# Altium project Liv_Flo_Sign.PrjPcb (part 1 of 2)
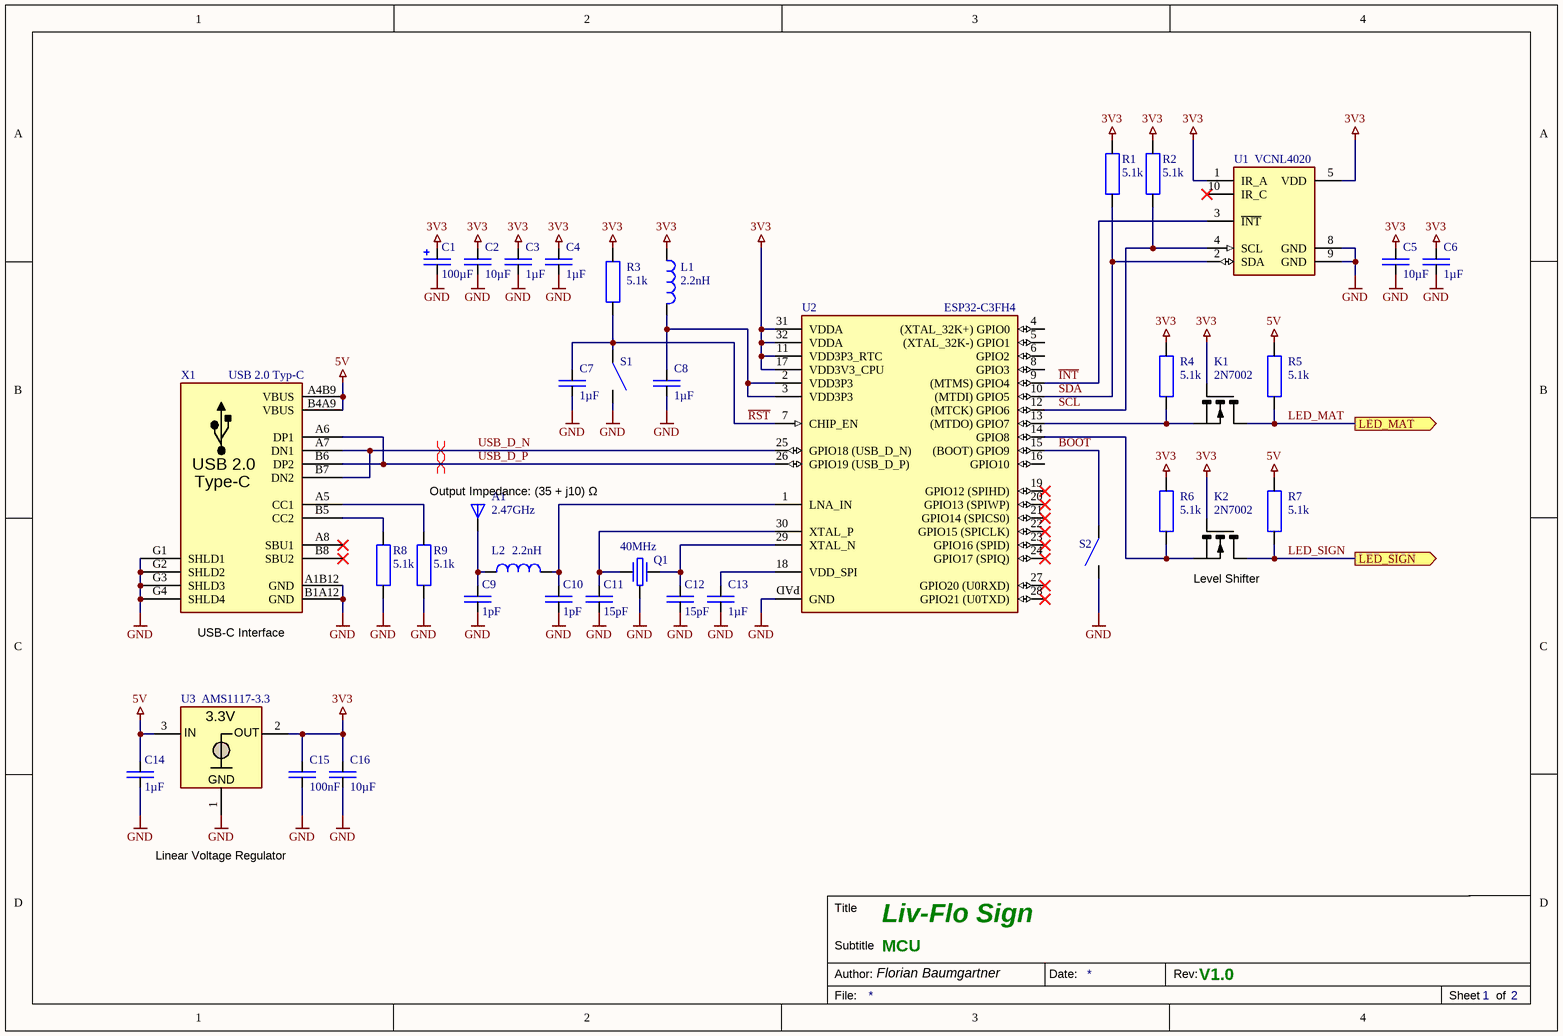
[diagram p0: Liv_Flo_Sign_MCU_V1.0.SchDoc]
2 sheets, 627 parts. Net scope: flat (ports and power ports of the same name join across sheets).
Board files: Liv_Flo_Sign_V1.0.PcbDoc, Liv_Flo_Sign_Feet_V1.0.PcbDoc
Sheets:
  Liv_Flo_Sign_MCU_V1.0.SchDoc
  Liv_Flo_Sign_LED_V1.0.SchDoc

## Sheet Liv_Flo_Sign_MCU_V1.0.SchDoc: Liv-Flo Sign
size A4; PageSetup: Record=PageOptions|CenterHorizontal=True|CenterVertical=True|PrintScale=0.97|XCorrection=1.00|YCorrection=1.00|PrintKind=0|BorderSize=5000000|LeftOffset=0|BottomOffset=0|Orientation=2|PaperLength=1000|PaperWidth=1000|Scale=100|PaperSource=7|PrintQuality=-3|MediaType=1|DitherType=10|PrintScaleMode=1|PaperKind=A4|PaperIndex=9; Organization: Crelin; Address2: Florian Baumgartner; DocumentNumber: MCU; Revision: V1.0; SheetNumber: 1; SheetTotal: 2; Author: Florian Baumgartner; Subtitle: Vertically Mounted Daughter-Board

### Parts
A1  2.47GHz  [SMD Chip-Antenna 7020 (SLDA72-2R470G-S1TF)]
C1  100µF  [SMD Tantalkondensator 1210 +]
C2  10µF  [SMD Keramikkondensator 0603]
C3  1µF  [SMD Keramikkondensator 0603]
C4  1µF  [SMD Keramikkondensator 0603]
C5  10µF  [SMD Keramikkondensator 0603]
C6  1µF  [SMD Keramikkondensator 0603]
C7  1µF  [SMD Keramikkondensator 0603]
C8  1µF  [SMD Keramikkondensator 0603]
C9  1pF  [SMD Keramikkondensator 0402]
C10  1pF  [SMD Keramikkondensator 0402]
C11  15pF  [SMD Keramikkondensator 0603]
C12  15pF  [SMD Keramikkondensator 0603]
C13  1µF  [SMD Keramikkondensator 0603]
C14  1µF  [SMD Keramikkondensator 0603]
C15  100nF  [SMD Keramikkondensator 0603]
C16  10µF  [SMD Keramikkondensator 0603]
K1  2N7002  [SMD MOSFET SOT-23]
K2  2N7002  [SMD MOSFET SOT-23]
L1  2.2nH  [SMD Inductor 0402]
L2  2.2nH  [SMD Inductor 0402]
Q1  40MHz  [SMD Crystal 2.5X2.0X0.5]
R1  5.1k  [SMD Widerstand 0603]
R2  5.1k  [SMD Widerstand 0603]
R3  5.1k  [SMD Widerstand 0603]
R4  5.1k  [SMD Widerstand 0603]
R5  5.1k  [SMD Widerstand 0603]
R6  5.1k  [SMD Widerstand 0603]
R7  5.1k  [SMD Widerstand 0603]
R8  5.1k  [SMD Widerstand 0603]
R9  5.1k  [SMD Widerstand 0603]
S1  SMD-Button  [SMD Button 4.2x3.2x2.5]  (value not drawn)
S2  SMD-Button  [SMD Button 4.2x3.2x2.5]  (value not drawn)
U1  VCNL4020  [SMD Proximity Sensor (VCNL4020)]
U2  ESP32-C3FH4  [SMD IC QFN-32]
U3  AMS1117-3.3  [SMD IC SOT-223]
X1  USB 2.0 Typ-C  [SMD USB-C Socket (A40-00119)]

### Ports
LED_MAT (out), LED_SIGN (out)

### Nets
3V3: C1.P(+) C2.2 C3.2 C4.2 C5.2 C6.2 C15.2 C16.2 K1.G K2.G L1.1 R1.1 R2.1 R3.1 R4.1 R6.1 U1.1(IR_A) U1.5(VDD) U2.11(VDD3P3_RTC) U2.17(VDD3V3_CPU) U2.31(VDDA) U2.32(VDDA) U3.2(OUT)
5V: C14.2 R5.1 R7.1 U3.3(IN) X1.A4B9(VBUS) X1.B4A9(VBUS)
GND: C1.M(-) C2.1 C3.1 C4.1 C5.1 C6.1 C7.1 C8.1 C9.2 C10.2 C11.2 C12.2 C13.1 C14.1 C15.1 C16.1 Q1.3 R8.2 R9.2 S1.2 S2.2 U1.8(GND) U1.9(GND) U2.PAD(GND) U3.1(GND) X1.A1B12(GND) X1.B1A12(GND) X1.G1(SHLD1) X1.G2(SHLD2) X1.G3(SHLD3) X1.G4(SHLD4)
BOOT: S2.1 U2.15((BOOT)_GPIO9)
~{INT}: U1.3(~{INT}) U2.9((MTMS)_GPIO4)
LED_MAT: K1.D R5.2 ; port LED_MAT
LED_SIGN: K2.D R7.2 ; port LED_SIGN
~{RST}: C7.2 R3.2 S1.1 U2.7(CHIP_EN)
SCL: R2.2 U1.4(SCL) U2.12((MTCK)_GPIO6)
SDA: R1.2 U1.2(SDA) U2.10((MTDI)_GPIO5)
USB_D_N: U2.25(GPIO18_(USB_D_N)) X1.A7(DN1) X1.B7(DN2)
USB_D_P: U2.26(GPIO19_(USB_D_P)) X1.A6(DP1) X1.B6(DP2)
NetA1_1: A1.1 C9.1 L2.1
NetC8_2: C8.2 L1.2 U2.2(VDD3P3) U2.3(VDD3P3)
NetC10_1: C10.1 L2.2 U2.1(LNA_IN)
NetC11_1: C11.1 Q1.1 U2.30(XTAL_P)
NetC12_1: C12.1 Q1.2 U2.29(XTAL_N)
NetC13_2: C13.2 U2.18(VDD_SPI)
NetK1_S: K1.S R4.2 U2.13((MTDO)_GPIO7)
NetK2_S: K2.S R6.2 U2.14(GPIO8)
NetR8_1: R8.1 X1.B5(CC2)
NetR9_1: R9.1 X1.A5(CC1)

Not connected (* = marked no-connect by the designer): U1 6(NC) 7(NC) 10(IR_C)*; U2 4((XTAL_32K+)_GPIO0) 5((XTAL_32K-)_GPIO1) 6(GPIO2) 8(GPIO3) 16(GPIO10) 19(GPIO12_(SPIHD))* 20(GPIO13_(SPIWP))* 21(GPIO14_(SPICS0))* 22(GPIO15_(SPICLK))* 23(GPIO16_(SPID))* 24(GPIO17_(SPIQ))* 27(GPIO20_(U0RXD))* 28(GPIO21_(U0TXD))*; X1 A8(SBU1)* B8(SBU2)*

### Layout directives
differential pair: USB_D_N, USB_D_P

### Notes on the sheet
- (near U2) Output Impedance: (35 + j10) Ω
- (near K2) Level Shifter
- (near X1) USB-C Interface
- Linear Voltage Regulator
- Title
- Author:
- Subtitle
- Date:
- Rev:
- File:
- Sheet
- of
- (in symbol U-AMS1117-3.3) 3.3V
- (in symbol X-USB-Buchse) USB 2.0; Type-C

### Library data of the parts
A1 = A-Chip-Antenna: Chip-Antenna; Component Value: SLDA72-2R470G-S1TF (2.47GHz); Digikey: 3442-SLDA72-2R470G-S1TFTR-ND; Component Description: Chip-Antenna; ComponentLink1Description: Datasheet; ComponentLink1URL: https://datasheet.lcsc.com/lcsc/2110081530_Sunlord-SLDA72-2R470G-S1TF_C370399.pdf; JLC-Parts: C370399; Unit Price: 0.20
C1 = C-ELCAP: CAP-Elko; Component Description: Tantalum Capacitor; Component Value: 100µF 6.3V; Digikey: 478-1677-1-ND; Farnell: 1135048; Mouser: 581-TAJB107K006R; JLC-Parts: C16133; Unit Price: 0.08
C2 C5 C16 = E6 - 10uF: SMD Ceramic Capacitor E6; Component Value: 10µF 10V; Component Description: Multilayer Ceramic Capacitors MLCC; ComponentLink1Description: Datasheet; ComponentLink1URL: https://datasheet.lcsc.com/lcsc/1810191219_Samsung-Electro-Mechanics-CL10A106KP8NNNC_C19702.pdf; Digikey: 587-3258-1-ND; Farnell: 2113070; JLC-Parts: C19702; Mouser: 963-LMK107BBJ106MALT; Unit Price: 0.01
C3 C4 C6-C8 C13 = C-CAPACITOR: CAP-MK; Component Description: Multilayer Ceramic Capacitors MLCC; Component Value: 1µF 50V; Digikey: 1276-1860-1-ND; Farnell: 3013383; Mouser: 187-CL10A105KB8NNNC; ComponentLink1Description: Datasheet; ComponentLink1URL: https://datasheet.lcsc.com/lcsc/1810261812_Samsung-Electro-Mechanics-CL10A105KB8NNNC_C15849.pdf; JLC-Parts: C15849; Unit Price: 0.01
C9 C10 = C-CAPACITOR: CAP-MK; Component Description: Multilayer Ceramic Capacitors; Component Value: 1pF 50V; Digikey: 490-13288-1-ND; Farnell: 3581492; Mouser: 81-GCM1555C1H1R0CA6D; JLC-Parts: C161149; Unit Price: 0.01
C11 C12 = C-CAPACITOR: CAP-MK; Component Description: Multilayer Ceramic Capacitors; Component Value: 15pF 50V; Digikey: 399-C0603C150J5GAC7867CT-ND; Farnell: 1414614; Mouser: 80-C0603C150J5G; JLC-Parts: C1644; Unit Price: 0.01
C14 = E6 - 1uF: SMD Ceramic Capacitor E6; Component Value: 1µF 50V; Component Description: Multilayer Ceramic Capacitors MLCC; ComponentLink1Description: Datasheet; ComponentLink1URL: https://datasheet.lcsc.com/lcsc/1810261812_Samsung-Electro-Mechanics-CL10A105KB8NNNC_C15849.pdf; Digikey: 1276-1860-1-ND; Farnell: 3013383; JLC-Parts: C15849; Mouser: 187-CL10A105KB8NNNC; Unit Price: 0.01
C15 = E6 - 100nF: SMD Ceramic Capacitor E6; Component Value: 100nF 50V; Component Description: Multilayer Ceramic Capacitors MLCC; ComponentLink1Description: Datasheet; ComponentLink1URL: https://datasheet.lcsc.com/lcsc/1809301912_YAGEO-CC0603KRX7R9BB104_C14663.pdf; Digikey: 445-6899-1-ND; Farnell: 2210822; JLC-Parts: C14663; Mouser: 810-CGA2B3X7R1H104K; Unit Price: 0.01
K1 K2 = K-FET:NIGE: MOSFET N-Channel; Digikey: 2N7002NCT-ND; Farnell: 1713823; Mouser: 512-2N7002; ComponentLink1Description: Datasheet; ComponentLink1URL: https://datasheet.lcsc.com/lcsc/1810151612_Jiangsu-Changjing-Electronics-Technology-Co---Ltd--2N7002_C8545.pdf; Component Description: MOSFET N-Channel; Component Value: 2N7002; JLC-Parts: C8545; Unit Price: 0.02
L1 L2 = R-COIL (HF): Chip Inductor; Farnell: 1343064; Mouser: 81-LQG15HN2N2S02D; Digikey: 490-1077-1-ND; Component Description: Chip Inductor; Component Value: 2.2nH; JLC-Parts: C918998; Unit Price: 0.01
Q1 = B-QUARZ-CAP: Component Description: Crystal; Digikey: XC2730CT-ND; Farnell: 4059221; Mouser: 520-400-8-36Q-CWYT; ComponentLink1Description: Datasheet; ComponentLink1URL: https://ecsxtal.com/store/pdf/ECX-2236Q.pdf; Component Value: 40Mhz; JLC-Parts: C524681; Unit Price: 0.16
R1-R9 = R-RESISTOR: RES (E=Heizwiderstand B=Messwandler); Component Description: Thick Film Chip Resistor; Component Value: 5.1k (75V, 100mW, 1%); Digikey: P5.10KHCT-ND; Farnell: 2059378; Mouser: 667-ERJ-3EKF5101V; JLC-Parts: C23186; Unit Price: 0.01
S1 S2 = Button 3mmx2.5mm: Button SPST; Component Value: SKRPACE010; Component Description: Tactile Switch; Digikey: 4809-SKRPACE010CT-ND; ComponentLink1Description: Datasheet; ComponentLink1URL: https://datasheet.lcsc.com/lcsc/1811051610_ALPSALPINE-SKRPACE010_C139797.pdf; Farnell: 3261825; JLC-Parts: C139797; Mouser: 688-SKRPACE010; Unit Price: 0.04
U1 = U-VCNL4020-GS08: Proximity and Ambient Light Sensor; Digikey: VCNL4020-GS08CT-ND; Farnell: 2251457; Mouser: 78-VCNL4020-GS08; ComponentLink1Description: Datasheet; ComponentLink1URL: https://www.vishay.com/docs/84276/veml6040.pdf; Component Description: Proximity and Ambient Light Sensor; Component Value: VCNL4020-GS08; JLC-Parts: C511034; Unit Price: 1.03
U2 = U-ESP32-C3FH4: 2.4 GHz Wi­Fi + Bluetooth® LE SoC; Digikey: 1904-ESP32-C3FH4CT-ND; Mouser: 356-ESP32-C3FH4; ComponentLink1Description: Datasheet; ComponentLink1URL: https://www.lcsc.com/datasheet/lcsc_datasheet_2312201733_Espressif-Systems-ESP32-C3FH4_C2858491.pdf; JLC-Parts: C2858491; Component Description: 2.4 GHz Wi­Fi + Bluetooth® LE SoC; Component Value: ESP32-C3FH4; Unit Price: 1.57
U3 = U-AMS1117-3.3: LDO Voltage Regulator; Component Value: AMS1117-3.3 (3.3V, 1A); Digikey: LM1117IMP-3.3/NOPBCT-ND; Farnell: 3116241; Mouser: 926-LM1117IMP3.3NOPB; ComponentLink1Description: Datasheet; ComponentLink1URL: https://datasheet.lcsc.com/lcsc/1811142212_Advanced-Monolithic-Systems-AMS1117-3-3_C6186.pdf; JLC-Parts: C6186; Component Description: LDO Voltage Regulator; Unit Price: 0.12
X1 = X-USB-Buchse: Typ-C; aliExpress: 33045191307; Component Description: USB Connector Type-C; Component Value: USB4105-GF-A; Digikey: 2073-USB4105-GF-ACT-ND; Farnell: 3583366; ComponentLink1Description: Datasheet; ComponentLink1URL: https://datasheet.lcsc.com/lcsc/2103051833_Jing-Extension-of-the-Electronic-Co--918-418K2023S40001_C167321.pdf; JLC-Parts: C167321; Unit Price: 0.34

## Sheet Liv_Flo_Sign_LED_V1.0.SchDoc: Liv-Flo Sign
size 594 x 420 mm; PageSetup: Record=PageOptions|CenterHorizontal=True|CenterVertical=True|PrintScale=0.97|XCorrection=1.00|YCorrection=1.00|PrintKind=0|BorderSize=5000000|LeftOffset=0|BottomOffset=0|Orientation=2|PaperLength=1000|PaperWidth=1000|Scale=100|PaperSource=7|PrintQuality=-3|MediaType=1|DitherType=10|PrintScaleMode=1|PaperKind=A4|PaperIndex=9; Organization: Crelin; Address2: Florian Baumgartner; DocumentNumber: LEDs; Revision: V1.0; SheetNumber: 2; SheetTotal: 2; Author: Florian Baumgartner; Subtitle: Vertically Mounted Daughter-Board
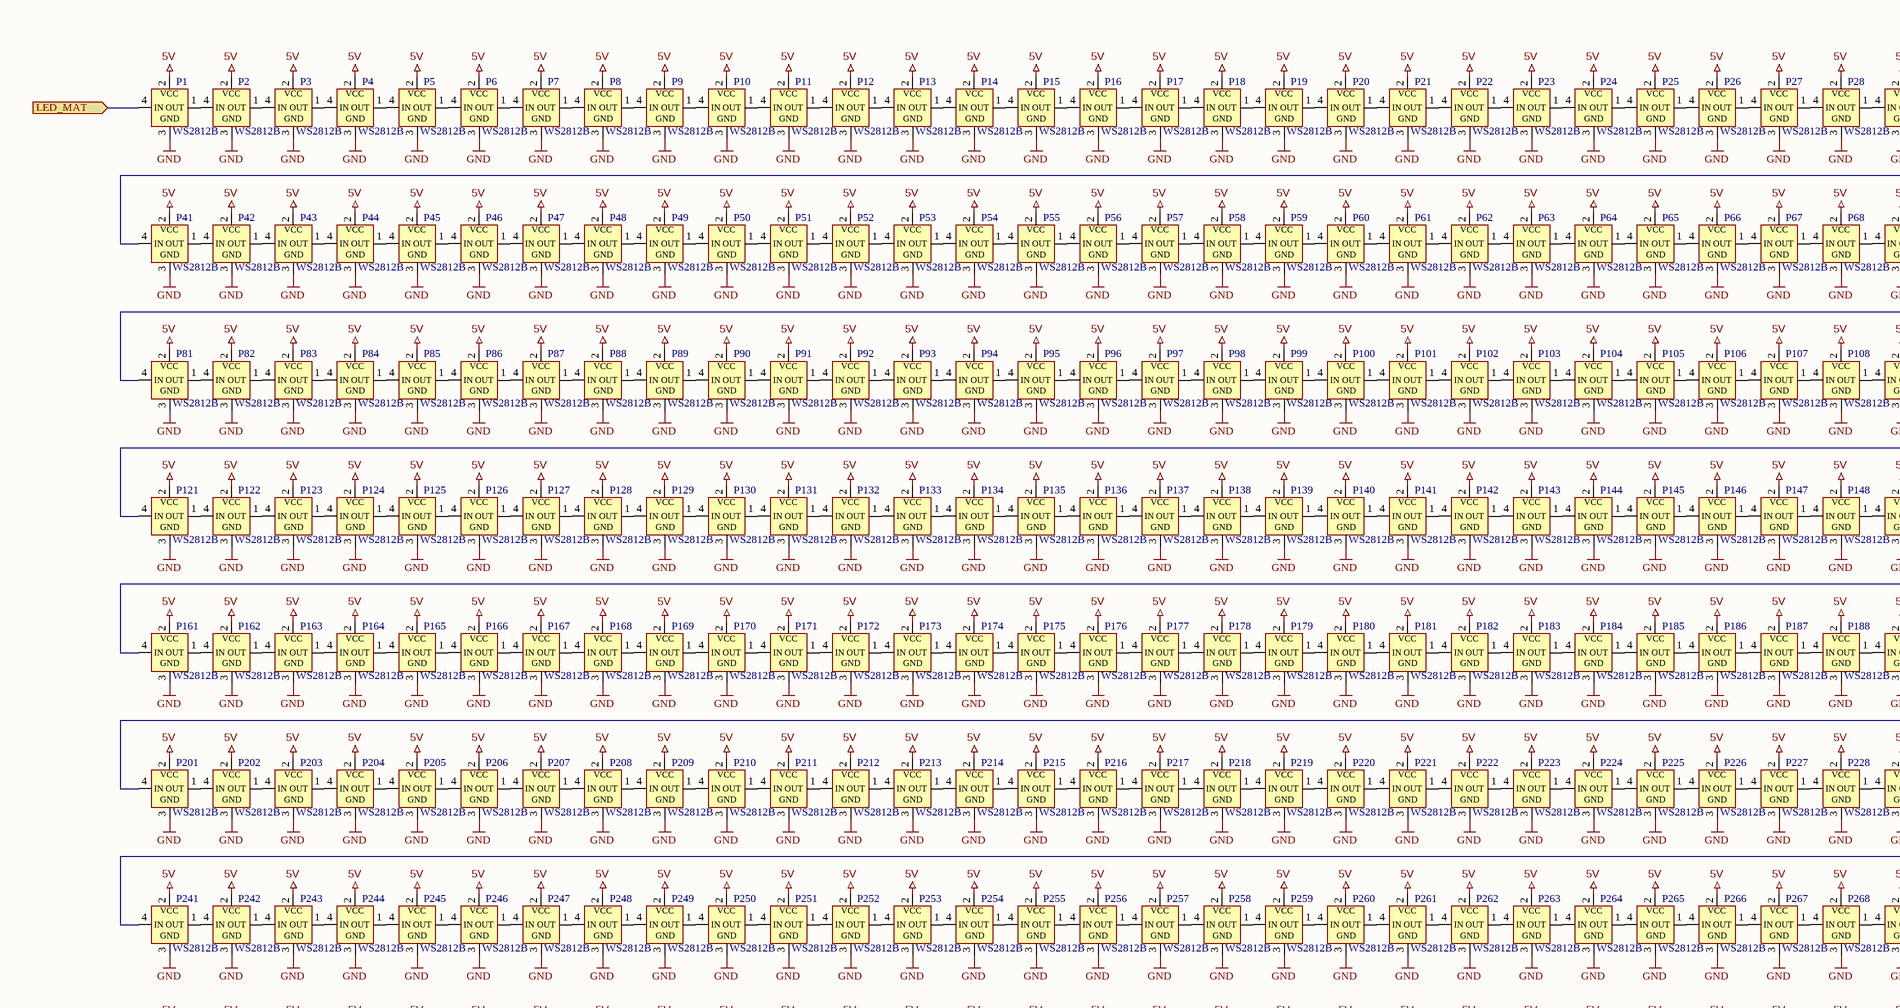
[diagram p1: Liv_Flo_Sign_LED_V1.0.SchDoc, top left]
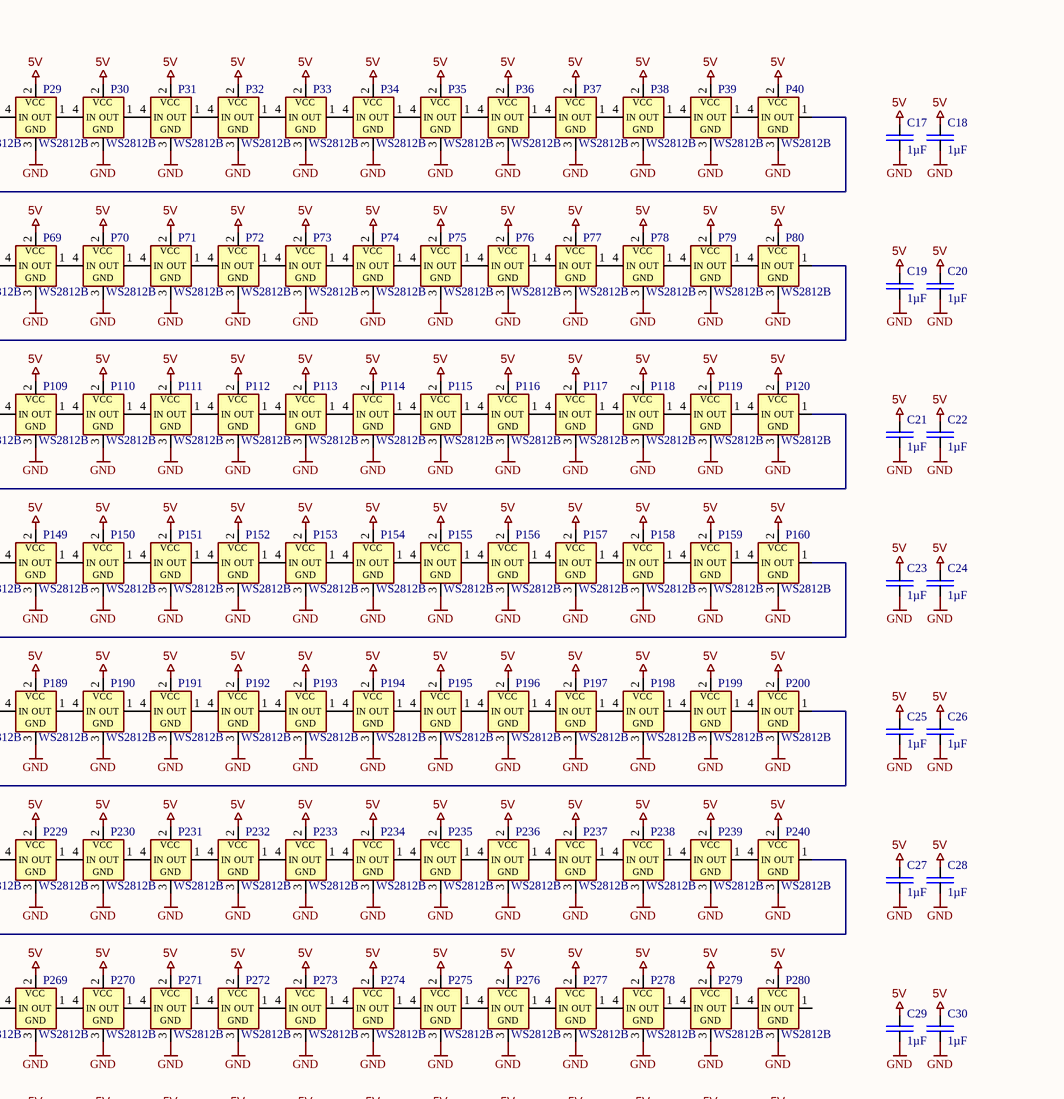
[diagram p2: Liv_Flo_Sign_LED_V1.0.SchDoc, top right]
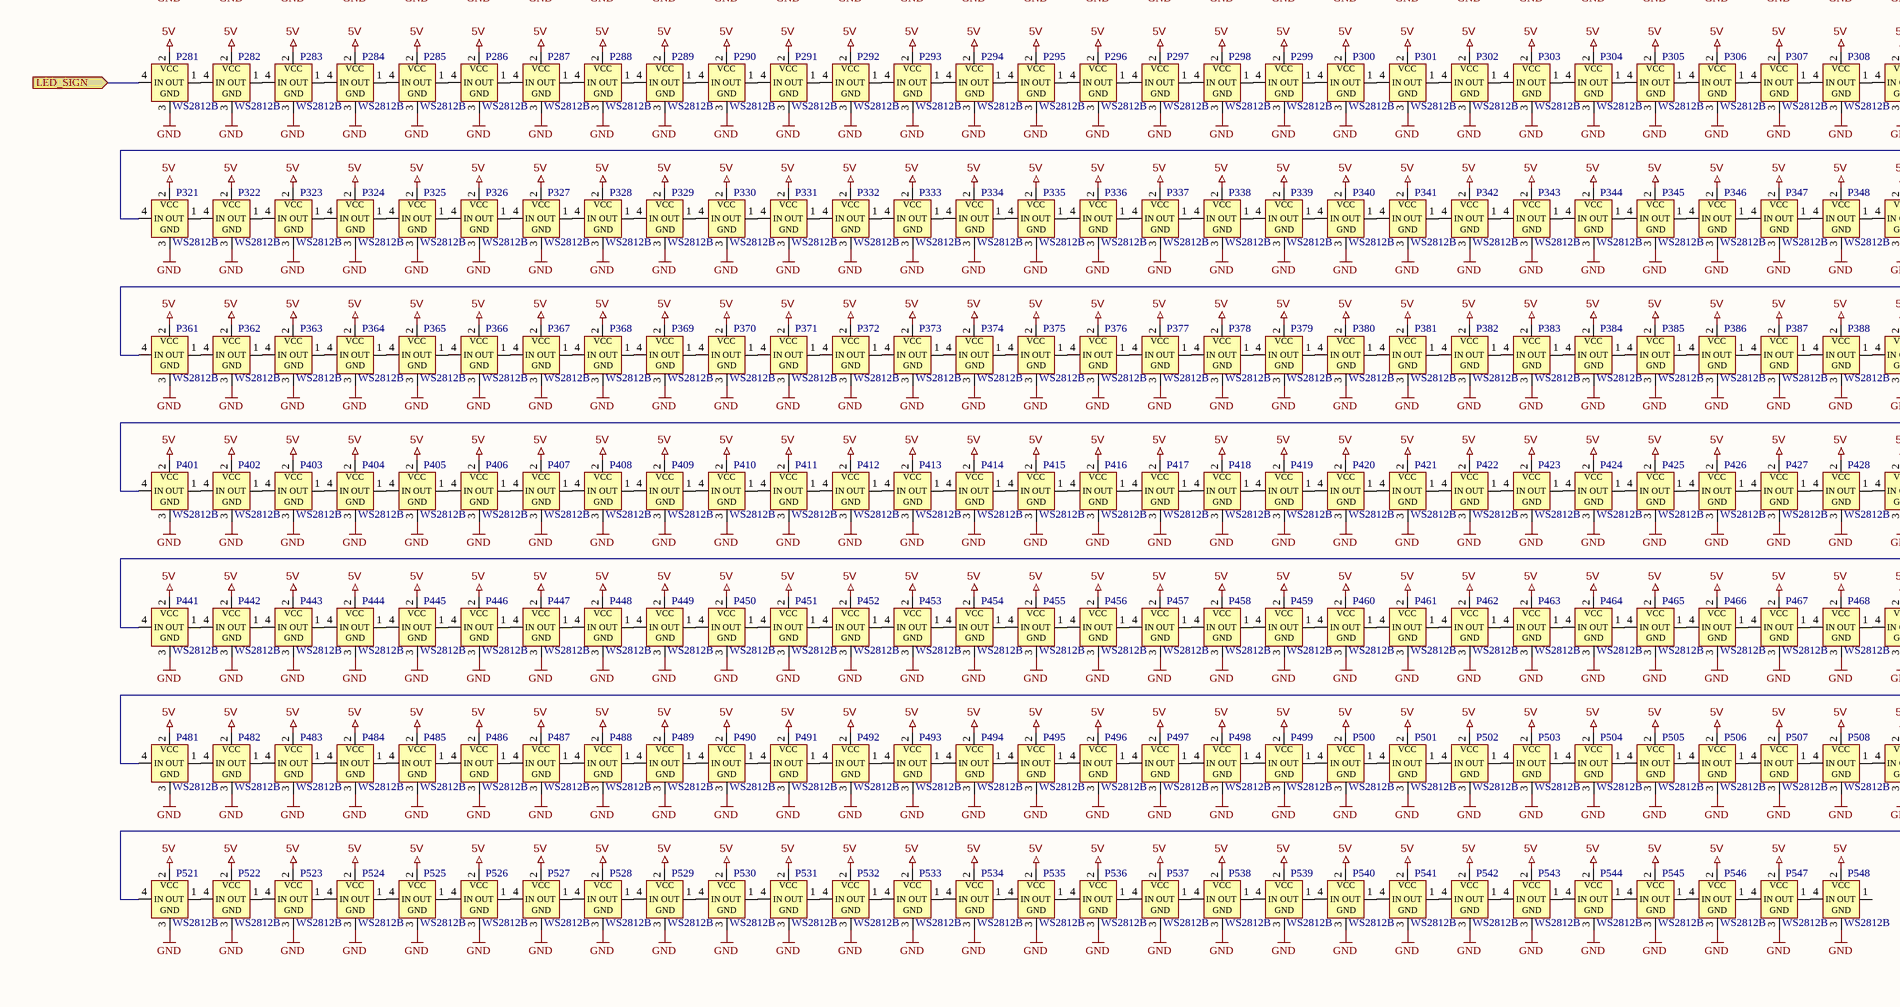
[diagram p3: Liv_Flo_Sign_LED_V1.0.SchDoc, bottom left]
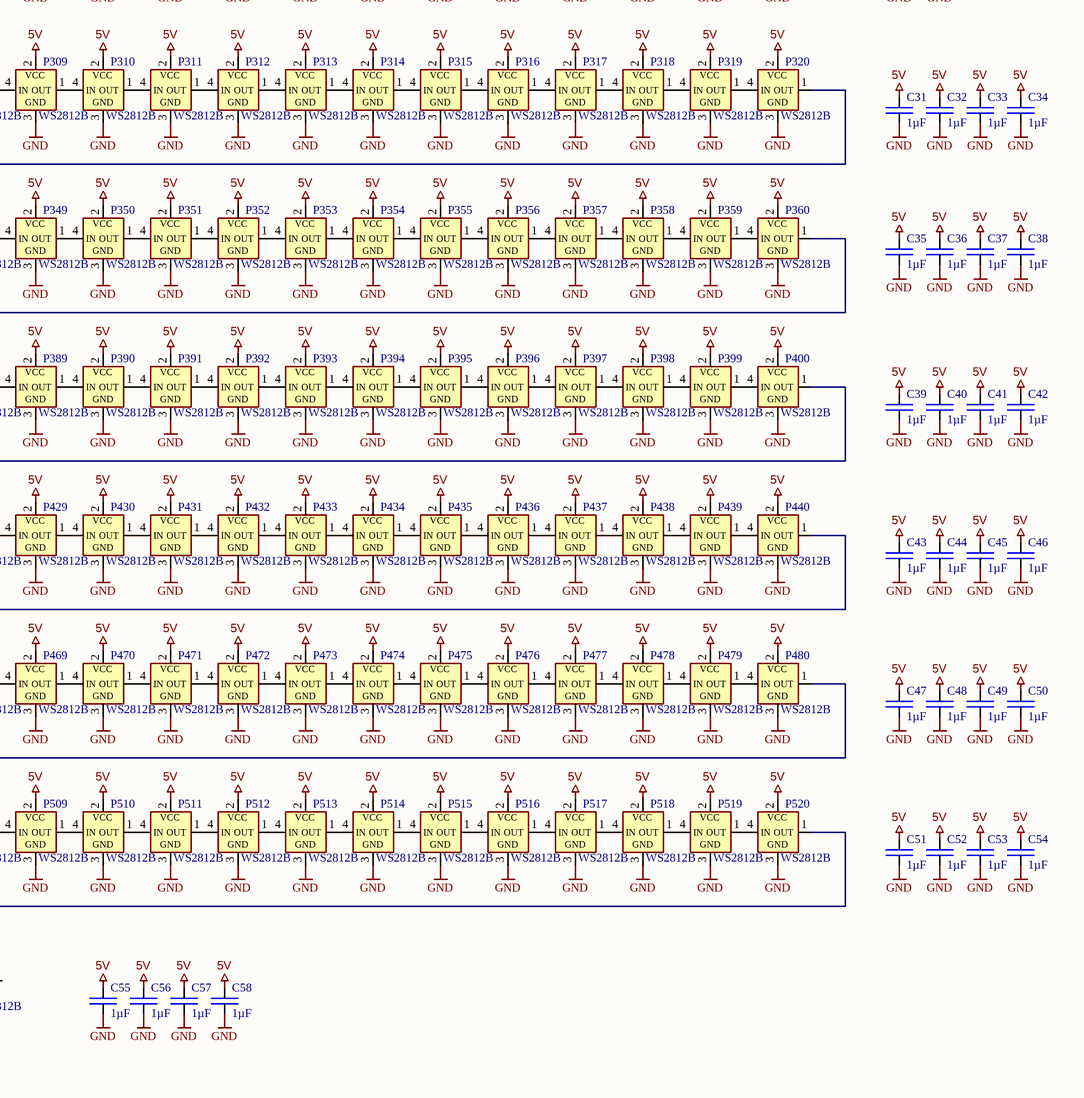
[diagram p4: Liv_Flo_Sign_LED_V1.0.SchDoc, bottom right]

### Parts
C17  1µF  [SMD Keramikkondensator 0402]
C18  1µF  [SMD Keramikkondensator 0402]
C19  1µF  [SMD Keramikkondensator 0402]
C20  1µF  [SMD Keramikkondensator 0402]
C21  1µF  [SMD Keramikkondensator 0402]
C22  1µF  [SMD Keramikkondensator 0402]
C23  1µF  [SMD Keramikkondensator 0402]
C24  1µF  [SMD Keramikkondensator 0402]
C25  1µF  [SMD Keramikkondensator 0402]
C26  1µF  [SMD Keramikkondensator 0402]
C27  1µF  [SMD Keramikkondensator 0402]
C28  1µF  [SMD Keramikkondensator 0402]
C29  1µF  [SMD Keramikkondensator 0402]
C30  1µF  [SMD Keramikkondensator 0402]
C31  1µF  [SMD Keramikkondensator 0402]
C32  1µF  [SMD Keramikkondensator 0402]
C33  1µF  [SMD Keramikkondensator 0402]
C34  1µF  [SMD Keramikkondensator 0402]
C35  1µF  [SMD Keramikkondensator 0402]
C36  1µF  [SMD Keramikkondensator 0402]
C37  1µF  [SMD Keramikkondensator 0402]
C38  1µF  [SMD Keramikkondensator 0402]
C39  1µF  [SMD Keramikkondensator 0402]
C40  1µF  [SMD Keramikkondensator 0402]
C41  1µF  [SMD Keramikkondensator 0402]
C42  1µF  [SMD Keramikkondensator 0402]
C43  1µF  [SMD Keramikkondensator 0402]
C44  1µF  [SMD Keramikkondensator 0402]
C45  1µF  [SMD Keramikkondensator 0402]
C46  1µF  [SMD Keramikkondensator 0402]
C47  1µF  [SMD Keramikkondensator 0402]
C48  1µF  [SMD Keramikkondensator 0402]
C49  1µF  [SMD Keramikkondensator 0402]
C50  1µF  [SMD Keramikkondensator 0402]
C51  1µF  [SMD Keramikkondensator 0402]
C52  1µF  [SMD Keramikkondensator 0402]
C53  1µF  [SMD Keramikkondensator 0402]
C54  1µF  [SMD Keramikkondensator 0402]
C55  1µF  [SMD Keramikkondensator 0402]
C56  1µF  [SMD Keramikkondensator 0402]
C57  1µF  [SMD Keramikkondensator 0402]
C58  1µF  [SMD Keramikkondensator 0402]
P1  WS2812B  [SMD LED WS2812B-1010RGBC]
P2  WS2812B  [SMD LED WS2812B-1010RGBC]
P3  WS2812B  [SMD LED WS2812B-1010RGBC]
P4  WS2812B  [SMD LED WS2812B-1010RGBC]
P5  WS2812B  [SMD LED WS2812B-1010RGBC]
P6  WS2812B  [SMD LED WS2812B-1010RGBC]
P7  WS2812B  [SMD LED WS2812B-1010RGBC]
P8  WS2812B  [SMD LED WS2812B-1010RGBC]
P9  WS2812B  [SMD LED WS2812B-1010RGBC]
P10  WS2812B  [SMD LED WS2812B-1010RGBC]
P11  WS2812B  [SMD LED WS2812B-1010RGBC]
P12  WS2812B  [SMD LED WS2812B-1010RGBC]
P13  WS2812B  [SMD LED WS2812B-1010RGBC]
P14  WS2812B  [SMD LED WS2812B-1010RGBC]
P15  WS2812B  [SMD LED WS2812B-1010RGBC]
P16  WS2812B  [SMD LED WS2812B-1010RGBC]
P17  WS2812B  [SMD LED WS2812B-1010RGBC]
P18  WS2812B  [SMD LED WS2812B-1010RGBC]
P19  WS2812B  [SMD LED WS2812B-1010RGBC]
P20  WS2812B  [SMD LED WS2812B-1010RGBC]
P21  WS2812B  [SMD LED WS2812B-1010RGBC]
P22  WS2812B  [SMD LED WS2812B-1010RGBC]
P23  WS2812B  [SMD LED WS2812B-1010RGBC]
P24  WS2812B  [SMD LED WS2812B-1010RGBC]
P25  WS2812B  [SMD LED WS2812B-1010RGBC]
P26  WS2812B  [SMD LED WS2812B-1010RGBC]
P27  WS2812B  [SMD LED WS2812B-1010RGBC]
P28  WS2812B  [SMD LED WS2812B-1010RGBC]
P29  WS2812B  [SMD LED WS2812B-1010RGBC]
P30  WS2812B  [SMD LED WS2812B-1010RGBC]
P31  WS2812B  [SMD LED WS2812B-1010RGBC]
P32  WS2812B  [SMD LED WS2812B-1010RGBC]
P33  WS2812B  [SMD LED WS2812B-1010RGBC]
P34  WS2812B  [SMD LED WS2812B-1010RGBC]
P35  WS2812B  [SMD LED WS2812B-1010RGBC]
P36  WS2812B  [SMD LED WS2812B-1010RGBC]
P37  WS2812B  [SMD LED WS2812B-1010RGBC]
P38  WS2812B  [SMD LED WS2812B-1010RGBC]
P39  WS2812B  [SMD LED WS2812B-1010RGBC]
P40  WS2812B  [SMD LED WS2812B-1010RGBC]
P41  WS2812B  [SMD LED WS2812B-1010RGBC]
P42  WS2812B  [SMD LED WS2812B-1010RGBC]
P43  WS2812B  [SMD LED WS2812B-1010RGBC]
P44  WS2812B  [SMD LED WS2812B-1010RGBC]
P45  WS2812B  [SMD LED WS2812B-1010RGBC]
P46  WS2812B  [SMD LED WS2812B-1010RGBC]
P47  WS2812B  [SMD LED WS2812B-1010RGBC]
P48  WS2812B  [SMD LED WS2812B-1010RGBC]
P49  WS2812B  [SMD LED WS2812B-1010RGBC]
P50  WS2812B  [SMD LED WS2812B-1010RGBC]
P51  WS2812B  [SMD LED WS2812B-1010RGBC]
P52  WS2812B  [SMD LED WS2812B-1010RGBC]
P53  WS2812B  [SMD LED WS2812B-1010RGBC]
P54  WS2812B  [SMD LED WS2812B-1010RGBC]
P55  WS2812B  [SMD LED WS2812B-1010RGBC]
P56  WS2812B  [SMD LED WS2812B-1010RGBC]
P57  WS2812B  [SMD LED WS2812B-1010RGBC]
P58  WS2812B  [SMD LED WS2812B-1010RGBC]
P59  WS2812B  [SMD LED WS2812B-1010RGBC]
P60  WS2812B  [SMD LED WS2812B-1010RGBC]
P61  WS2812B  [SMD LED WS2812B-1010RGBC]
P62  WS2812B  [SMD LED WS2812B-1010RGBC]
P63  WS2812B  [SMD LED WS2812B-1010RGBC]
P64  WS2812B  [SMD LED WS2812B-1010RGBC]
P65  WS2812B  [SMD LED WS2812B-1010RGBC]
P66  WS2812B  [SMD LED WS2812B-1010RGBC]
P67  WS2812B  [SMD LED WS2812B-1010RGBC]
P68  WS2812B  [SMD LED WS2812B-1010RGBC]
P69  WS2812B  [SMD LED WS2812B-1010RGBC]
P70  WS2812B  [SMD LED WS2812B-1010RGBC]
P71  WS2812B  [SMD LED WS2812B-1010RGBC]
P72  WS2812B  [SMD LED WS2812B-1010RGBC]
P73  WS2812B  [SMD LED WS2812B-1010RGBC]
P74  WS2812B  [SMD LED WS2812B-1010RGBC]
P75  WS2812B  [SMD LED WS2812B-1010RGBC]
P76  WS2812B  [SMD LED WS2812B-1010RGBC]
P77  WS2812B  [SMD LED WS2812B-1010RGBC]
P78  WS2812B  [SMD LED WS2812B-1010RGBC]
P79  WS2812B  [SMD LED WS2812B-1010RGBC]
P80  WS2812B  [SMD LED WS2812B-1010RGBC]
P81  WS2812B  [SMD LED WS2812B-1010RGBC]
P82  WS2812B  [SMD LED WS2812B-1010RGBC]
P83  WS2812B  [SMD LED WS2812B-1010RGBC]
P84  WS2812B  [SMD LED WS2812B-1010RGBC]
P85  WS2812B  [SMD LED WS2812B-1010RGBC]
P86  WS2812B  [SMD LED WS2812B-1010RGBC]
P87  WS2812B  [SMD LED WS2812B-1010RGBC]
P88  WS2812B  [SMD LED WS2812B-1010RGBC]
P89  WS2812B  [SMD LED WS2812B-1010RGBC]
P90  WS2812B  [SMD LED WS2812B-1010RGBC]
P91  WS2812B  [SMD LED WS2812B-1010RGBC]
P92  WS2812B  [SMD LED WS2812B-1010RGBC]
P93  WS2812B  [SMD LED WS2812B-1010RGBC]
P94  WS2812B  [SMD LED WS2812B-1010RGBC]
P95  WS2812B  [SMD LED WS2812B-1010RGBC]
P96  WS2812B  [SMD LED WS2812B-1010RGBC]
P97  WS2812B  [SMD LED WS2812B-1010RGBC]
P98  WS2812B  [SMD LED WS2812B-1010RGBC]
P99  WS2812B  [SMD LED WS2812B-1010RGBC]
P100  WS2812B  [SMD LED WS2812B-1010RGBC]
P101  WS2812B  [SMD LED WS2812B-1010RGBC]
P102  WS2812B  [SMD LED WS2812B-1010RGBC]
P103  WS2812B  [SMD LED WS2812B-1010RGBC]
P104  WS2812B  [SMD LED WS2812B-1010RGBC]
P105  WS2812B  [SMD LED WS2812B-1010RGBC]
P106  WS2812B  [SMD LED WS2812B-1010RGBC]
P107  WS2812B  [SMD LED WS2812B-1010RGBC]
P108  WS2812B  [SMD LED WS2812B-1010RGBC]
P109  WS2812B  [SMD LED WS2812B-1010RGBC]
P110  WS2812B  [SMD LED WS2812B-1010RGBC]
P111  WS2812B  [SMD LED WS2812B-1010RGBC]
P112  WS2812B  [SMD LED WS2812B-1010RGBC]
P113  WS2812B  [SMD LED WS2812B-1010RGBC]
P114  WS2812B  [SMD LED WS2812B-1010RGBC]
P115  WS2812B  [SMD LED WS2812B-1010RGBC]
P116  WS2812B  [SMD LED WS2812B-1010RGBC]
P117  WS2812B  [SMD LED WS2812B-1010RGBC]
P118  WS2812B  [SMD LED WS2812B-1010RGBC]
P119  WS2812B  [SMD LED WS2812B-1010RGBC]
P120  WS2812B  [SMD LED WS2812B-1010RGBC]
P121  WS2812B  [SMD LED WS2812B-1010RGBC]
P122  WS2812B  [SMD LED WS2812B-1010RGBC]
P123  WS2812B  [SMD LED WS2812B-1010RGBC]
P124  WS2812B  [SMD LED WS2812B-1010RGBC]
P125  WS2812B  [SMD LED WS2812B-1010RGBC]
P126  WS2812B  [SMD LED WS2812B-1010RGBC]
P127  WS2812B  [SMD LED WS2812B-1010RGBC]
P128  WS2812B  [SMD LED WS2812B-1010RGBC]
P129  WS2812B  [SMD LED WS2812B-1010RGBC]
P130  WS2812B  [SMD LED WS2812B-1010RGBC]
P131  WS2812B  [SMD LED WS2812B-1010RGBC]
P132  WS2812B  [SMD LED WS2812B-1010RGBC]
P133  WS2812B  [SMD LED WS2812B-1010RGBC]
P134  WS2812B  [SMD LED WS2812B-1010RGBC]
P135  WS2812B  [SMD LED WS2812B-1010RGBC]
P136  WS2812B  [SMD LED WS2812B-1010RGBC]
P137  WS2812B  [SMD LED WS2812B-1010RGBC]
P138  WS2812B  [SMD LED WS2812B-1010RGBC]
P139  WS2812B  [SMD LED WS2812B-1010RGBC]
P140  WS2812B  [SMD LED WS2812B-1010RGBC]
P141  WS2812B  [SMD LED WS2812B-1010RGBC]
P142  WS2812B  [SMD LED WS2812B-1010RGBC]
P143  WS2812B  [SMD LED WS2812B-1010RGBC]
P144  WS2812B  [SMD LED WS2812B-1010RGBC]
P145  WS2812B  [SMD LED WS2812B-1010RGBC]
P146  WS2812B  [SMD LED WS2812B-1010RGBC]
P147  WS2812B  [SMD LED WS2812B-1010RGBC]
P148  WS2812B  [SMD LED WS2812B-1010RGBC]
P149  WS2812B  [SMD LED WS2812B-1010RGBC]
P150  WS2812B  [SMD LED WS2812B-1010RGBC]
P151  WS2812B  [SMD LED WS2812B-1010RGBC]
P152  WS2812B  [SMD LED WS2812B-1010RGBC]
P153  WS2812B  [SMD LED WS2812B-1010RGBC]
P154  WS2812B  [SMD LED WS2812B-1010RGBC]
P155  WS2812B  [SMD LED WS2812B-1010RGBC]
P156  WS2812B  [SMD LED WS2812B-1010RGBC]
P157  WS2812B  [SMD LED WS2812B-1010RGBC]
P158  WS2812B  [SMD LED WS2812B-1010RGBC]
P159  WS2812B  [SMD LED WS2812B-1010RGBC]
P160  WS2812B  [SMD LED WS2812B-1010RGBC]
P161  WS2812B  [SMD LED WS2812B-1010RGBC]
P162  WS2812B  [SMD LED WS2812B-1010RGBC]
P163  WS2812B  [SMD LED WS2812B-1010RGBC]
P164  WS2812B  [SMD LED WS2812B-1010RGBC]
P165  WS2812B  [SMD LED WS2812B-1010RGBC]
P166  WS2812B  [SMD LED WS2812B-1010RGBC]
P167  WS2812B  [SMD LED WS2812B-1010RGBC]
P168  WS2812B  [SMD LED WS2812B-1010RGBC]
P169  WS2812B  [SMD LED WS2812B-1010RGBC]
P170  WS2812B  [SMD LED WS2812B-1010RGBC]
P171  WS2812B  [SMD LED WS2812B-1010RGBC]
P172  WS2812B  [SMD LED WS2812B-1010RGBC]
P173  WS2812B  [SMD LED WS2812B-1010RGBC]
P174  WS2812B  [SMD LED WS2812B-1010RGBC]
P175  WS2812B  [SMD LED WS2812B-1010RGBC]
P176  WS2812B  [SMD LED WS2812B-1010RGBC]
P177  WS2812B  [SMD LED WS2812B-1010RGBC]
P178  WS2812B  [SMD LED WS2812B-1010RGBC]
P179  WS2812B  [SMD LED WS2812B-1010RGBC]
P180  WS2812B  [SMD LED WS2812B-1010RGBC]
P181  WS2812B  [SMD LED WS2812B-1010RGBC]
P182  WS2812B  [SMD LED WS2812B-1010RGBC]
P183  WS2812B  [SMD LED WS2812B-1010RGBC]
P184  WS2812B  [SMD LED WS2812B-1010RGBC]
P185  WS2812B  [SMD LED WS2812B-1010RGBC]
P186  WS2812B  [SMD LED WS2812B-1010RGBC]
P187  WS2812B  [SMD LED WS2812B-1010RGBC]
P188  WS2812B  [SMD LED WS2812B-1010RGBC]
P189  WS2812B  [SMD LED WS2812B-1010RGBC]
P190  WS2812B  [SMD LED WS2812B-1010RGBC]
P191  WS2812B  [SMD LED WS2812B-1010RGBC]
P192  WS2812B  [SMD LED WS2812B-1010RGBC]
P193  WS2812B  [SMD LED WS2812B-1010RGBC]
P194  WS2812B  [SMD LED WS2812B-1010RGBC]
P195  WS2812B  [SMD LED WS2812B-1010RGBC]
P196  WS2812B  [SMD LED WS2812B-1010RGBC]
P197  WS2812B  [SMD LED WS2812B-1010RGBC]
P198  WS2812B  [SMD LED WS2812B-1010RGBC]
P199  WS2812B  [SMD LED WS2812B-1010RGBC]
P200  WS2812B  [SMD LED WS2812B-1010RGBC]
P201  WS2812B  [SMD LED WS2812B-1010RGBC]
P202  WS2812B  [SMD LED WS2812B-1010RGBC]
P203  WS2812B  [SMD LED WS2812B-1010RGBC]
P204  WS2812B  [SMD LED WS2812B-1010RGBC]
P205  WS2812B  [SMD LED WS2812B-1010RGBC]
P206  WS2812B  [SMD LED WS2812B-1010RGBC]
P207  WS2812B  [SMD LED WS2812B-1010RGBC]
P208  WS2812B  [SMD LED WS2812B-1010RGBC]
P209  WS2812B  [SMD LED WS2812B-1010RGBC]
P210  WS2812B  [SMD LED WS2812B-1010RGBC]
P211  WS2812B  [SMD LED WS2812B-1010RGBC]
P212  WS2812B  [SMD LED WS2812B-1010RGBC]
P213  WS2812B  [SMD LED WS2812B-1010RGBC]
P214  WS2812B  [SMD LED WS2812B-1010RGBC]
P215  WS2812B  [SMD LED WS2812B-1010RGBC]
P216  WS2812B  [SMD LED WS2812B-1010RGBC]
P217  WS2812B  [SMD LED WS2812B-1010RGBC]
P218  WS2812B  [SMD LED WS2812B-1010RGBC]
P219  WS2812B  [SMD LED WS2812B-1010RGBC]
P220  WS2812B  [SMD LED WS2812B-1010RGBC]
P221  WS2812B  [SMD LED WS2812B-1010RGBC]
P222  WS2812B  [SMD LED WS2812B-1010RGBC]
P223  WS2812B  [SMD LED WS2812B-1010RGBC]
P224  WS2812B  [SMD LED WS2812B-1010RGBC]
P225  WS2812B  [SMD LED WS2812B-1010RGBC]
P226  WS2812B  [SMD LED WS2812B-1010RGBC]
P227  WS2812B  [SMD LED WS2812B-1010RGBC]
P228  WS2812B  [SMD LED WS2812B-1010RGBC]
P229  WS2812B  [SMD LED WS2812B-1010RGBC]
P230  WS2812B  [SMD LED WS2812B-1010RGBC]
P231  WS2812B  [SMD LED WS2812B-1010RGBC]
P232  WS2812B  [SMD LED WS2812B-1010RGBC]
P233  WS2812B  [SMD LED WS2812B-1010RGBC]
P234  WS2812B  [SMD LED WS2812B-1010RGBC]
P235  WS2812B  [SMD LED WS2812B-1010RGBC]
P236  WS2812B  [SMD LED WS2812B-1010RGBC]
P237  WS2812B  [SMD LED WS2812B-1010RGBC]
P238  WS2812B  [SMD LED WS2812B-1010RGBC]
P239  WS2812B  [SMD LED WS2812B-1010RGBC]
P240  WS2812B  [SMD LED WS2812B-1010RGBC]
P241  WS2812B  [SMD LED WS2812B-1010RGBC]
P242  WS2812B  [SMD LED WS2812B-1010RGBC]
P243  WS2812B  [SMD LED WS2812B-1010RGBC]
P244  WS2812B  [SMD LED WS2812B-1010RGBC]
P245  WS2812B  [SMD LED WS2812B-1010RGBC]
P246  WS2812B  [SMD LED WS2812B-1010RGBC]
P247  WS2812B  [SMD LED WS2812B-1010RGBC]
P248  WS2812B  [SMD LED WS2812B-1010RGBC]
P249  WS2812B  [SMD LED WS2812B-1010RGBC]
P250  WS2812B  [SMD LED WS2812B-1010RGBC]
P251  WS2812B  [SMD LED WS2812B-1010RGBC]
P252  WS2812B  [SMD LED WS2812B-1010RGBC]
P253  WS2812B  [SMD LED WS2812B-1010RGBC]
P254  WS2812B  [SMD LED WS2812B-1010RGBC]
P255  WS2812B  [SMD LED WS2812B-1010RGBC]
P256  WS2812B  [SMD LED WS2812B-1010RGBC]
P257  WS2812B  [SMD LED WS2812B-1010RGBC]
P258  WS2812B  [SMD LED WS2812B-1010RGBC]
P259  WS2812B  [SMD LED WS2812B-1010RGBC]
P260  WS2812B  [SMD LED WS2812B-1010RGBC]
P261  WS2812B  [SMD LED WS2812B-1010RGBC]
P262  WS2812B  [SMD LED WS2812B-1010RGBC]
P263  WS2812B  [SMD LED WS2812B-1010RGBC]
P264  WS2812B  [SMD LED WS2812B-1010RGBC]
P265  WS2812B  [SMD LED WS2812B-1010RGBC]
P266  WS2812B  [SMD LED WS2812B-1010RGBC]
P267  WS2812B  [SMD LED WS2812B-1010RGBC]
P268  WS2812B  [SMD LED WS2812B-1010RGBC]
P269  WS2812B  [SMD LED WS2812B-1010RGBC]
P270  WS2812B  [SMD LED WS2812B-1010RGBC]
P271  WS2812B  [SMD LED WS2812B-1010RGBC]
P272  WS2812B  [SMD LED WS2812B-1010RGBC]
P273  WS2812B  [SMD LED WS2812B-1010RGBC]
P274  WS2812B  [SMD LED WS2812B-1010RGBC]
P275  WS2812B  [SMD LED WS2812B-1010RGBC]
P276  WS2812B  [SMD LED WS2812B-1010RGBC]
P277  WS2812B  [SMD LED WS2812B-1010RGBC]
P278  WS2812B  [SMD LED WS2812B-1010RGBC]
P279  WS2812B  [SMD LED WS2812B-1010RGBC]
P280  WS2812B  [SMD LED WS2812B-1010RGBC]
P281  WS2812B  [SMD LED WS2812B-1010RGBC]
P282  WS2812B  [SMD LED WS2812B-1010RGBC]
P283  WS2812B  [SMD LED WS2812B-1010RGBC]
P284  WS2812B  [SMD LED WS2812B-1010RGBC]
P285  WS2812B  [SMD LED WS2812B-1010RGBC]
P286  WS2812B  [SMD LED WS2812B-1010RGBC]
P287  WS2812B  [SMD LED WS2812B-1010RGBC]
P288  WS2812B  [SMD LED WS2812B-1010RGBC]
P289  WS2812B  [SMD LED WS2812B-1010RGBC]
P290  WS2812B  [SMD LED WS2812B-1010RGBC]
P291  WS2812B  [SMD LED WS2812B-1010RGBC]
P292  WS2812B  [SMD LED WS2812B-1010RGBC]
P293  WS2812B  [SMD LED WS2812B-1010RGBC]
P294  WS2812B  [SMD LED WS2812B-1010RGBC]
P295  WS2812B  [SMD LED WS2812B-1010RGBC]
P296  WS2812B  [SMD LED WS2812B-1010RGBC]
P297  WS2812B  [SMD LED WS2812B-1010RGBC]
P298  WS2812B  [SMD LED WS2812B-1010RGBC]
P299  WS2812B  [SMD LED WS2812B-1010RGBC]
P300  WS2812B  [SMD LED WS2812B-1010RGBC]
P301  WS2812B  [SMD LED WS2812B-1010RGBC]
P302  WS2812B  [SMD LED WS2812B-1010RGBC]
P303  WS2812B  [SMD LED WS2812B-1010RGBC]
P304  WS2812B  [SMD LED WS2812B-1010RGBC]
P305  WS2812B  [SMD LED WS2812B-1010RGBC]
P306  WS2812B  [SMD LED WS2812B-1010RGBC]
P307  WS2812B  [SMD LED WS2812B-1010RGBC]
P308  WS2812B  [SMD LED WS2812B-1010RGBC]
P309  WS2812B  [SMD LED WS2812B-1010RGBC]
P310  WS2812B  [SMD LED WS2812B-1010RGBC]
P311  WS2812B  [SMD LED WS2812B-1010RGBC]
P312  WS2812B  [SMD LED WS2812B-1010RGBC]
P313  WS2812B  [SMD LED WS2812B-1010RGBC]
P314  WS2812B  [SMD LED WS2812B-1010RGBC]
P315  WS2812B  [SMD LED WS2812B-1010RGBC]
P316  WS2812B  [SMD LED WS2812B-1010RGBC]
P317  WS2812B  [SMD LED WS2812B-1010RGBC]
P318  WS2812B  [SMD LED WS2812B-1010RGBC]
P319  WS2812B  [SMD LED WS2812B-1010RGBC]
P320  WS2812B  [SMD LED WS2812B-1010RGBC]
P321  WS2812B  [SMD LED WS2812B-1010RGBC]
P322  WS2812B  [SMD LED WS2812B-1010RGBC]
P323  WS2812B  [SMD LED WS2812B-1010RGBC]
P324  WS2812B  [SMD LED WS2812B-1010RGBC]
P325  WS2812B  [SMD LED WS2812B-1010RGBC]
P326  WS2812B  [SMD LED WS2812B-1010RGBC]
P327  WS2812B  [SMD LED WS2812B-1010RGBC]
P328  WS2812B  [SMD LED WS2812B-1010RGBC]
P329  WS2812B  [SMD LED WS2812B-1010RGBC]
P330  WS2812B  [SMD LED WS2812B-1010RGBC]
P331  WS2812B  [SMD LED WS2812B-1010RGBC]
P332  WS2812B  [SMD LED WS2812B-1010RGBC]
P333  WS2812B  [SMD LED WS2812B-1010RGBC]
P334  WS2812B  [SMD LED WS2812B-1010RGBC]
P335  WS2812B  [SMD LED WS2812B-1010RGBC]
P336  WS2812B  [SMD LED WS2812B-1010RGBC]
P337  WS2812B  [SMD LED WS2812B-1010RGBC]
P338  WS2812B  [SMD LED WS2812B-1010RGBC]
P339  WS2812B  [SMD LED WS2812B-1010RGBC]
P340  WS2812B  [SMD LED WS2812B-1010RGBC]
P341  WS2812B  [SMD LED WS2812B-1010RGBC]
P342  WS2812B  [SMD LED WS2812B-1010RGBC]
P343  WS2812B  [SMD LED WS2812B-1010RGBC]
P344  WS2812B  [SMD LED WS2812B-1010RGBC]
P345  WS2812B  [SMD LED WS2812B-1010RGBC]
P346  WS2812B  [SMD LED WS2812B-1010RGBC]
P347  WS2812B  [SMD LED WS2812B-1010RGBC]
P348  WS2812B  [SMD LED WS2812B-1010RGBC]
P349  WS2812B  [SMD LED WS2812B-1010RGBC]
P350  WS2812B  [SMD LED WS2812B-1010RGBC]
P351  WS2812B  [SMD LED WS2812B-1010RGBC]
P352  WS2812B  [SMD LED WS2812B-1010RGBC]
P353  WS2812B  [SMD LED WS2812B-1010RGBC]
P354  WS2812B  [SMD LED WS2812B-1010RGBC]
P355  WS2812B  [SMD LED WS2812B-1010RGBC]
P356  WS2812B  [SMD LED WS2812B-1010RGBC]
P357  WS2812B  [SMD LED WS2812B-1010RGBC]
P358  WS2812B  [SMD LED WS2812B-1010RGBC]
P359  WS2812B  [SMD LED WS2812B-1010RGBC]
P360  WS2812B  [SMD LED WS2812B-1010RGBC]
P361  WS2812B  [SMD LED WS2812B-1010RGBC]
P362  WS2812B  [SMD LED WS2812B-1010RGBC]
P363  WS2812B  [SMD LED WS2812B-1010RGBC]
P364  WS2812B  [SMD LED WS2812B-1010RGBC]
P365  WS2812B  [SMD LED WS2812B-1010RGBC]
P366  WS2812B  [SMD LED WS2812B-1010RGBC]
P367  WS2812B  [SMD LED WS2812B-1010RGBC]
P368  WS2812B  [SMD LED WS2812B-1010RGBC]
P369  WS2812B  [SMD LED WS2812B-1010RGBC]
P370  WS2812B  [SMD LED WS2812B-1010RGBC]
P371  WS2812B  [SMD LED WS2812B-1010RGBC]
P372  WS2812B  [SMD LED WS2812B-1010RGBC]
P373  WS2812B  [SMD LED WS2812B-1010RGBC]
P374  WS2812B  [SMD LED WS2812B-1010RGBC]
P375  WS2812B  [SMD LED WS2812B-1010RGBC]
P376  WS2812B  [SMD LED WS2812B-1010RGBC]
P377  WS2812B  [SMD LED WS2812B-1010RGBC]
P378  WS2812B  [SMD LED WS2812B-1010RGBC]
P379  WS2812B  [SMD LED WS2812B-1010RGBC]
P380  WS2812B  [SMD LED WS2812B-1010RGBC]
P381  WS2812B  [SMD LED WS2812B-1010RGBC]
P382  WS2812B  [SMD LED WS2812B-1010RGBC]
P383  WS2812B  [SMD LED WS2812B-1010RGBC]
P384  WS2812B  [SMD LED WS2812B-1010RGBC]
P385  WS2812B  [SMD LED WS2812B-1010RGBC]
P386  WS2812B  [SMD LED WS2812B-1010RGBC]
P387  WS2812B  [SMD LED WS2812B-1010RGBC]
P388  WS2812B  [SMD LED WS2812B-1010RGBC]
P389  WS2812B  [SMD LED WS2812B-1010RGBC]
P390  WS2812B  [SMD LED WS2812B-1010RGBC]
P391  WS2812B  [SMD LED WS2812B-1010RGBC]
P392  WS2812B  [SMD LED WS2812B-1010RGBC]
P393  WS2812B  [SMD LED WS2812B-1010RGBC]
P394  WS2812B  [SMD LED WS2812B-1010RGBC]
P395  WS2812B  [SMD LED WS2812B-1010RGBC]
P396  WS2812B  [SMD LED WS2812B-1010RGBC]
P397  WS2812B  [SMD LED WS2812B-1010RGBC]
P398  WS2812B  [SMD LED WS2812B-1010RGBC]
P399  WS2812B  [SMD LED WS2812B-1010RGBC]
P400  WS2812B  [SMD LED WS2812B-1010RGBC]
P401  WS2812B  [SMD LED WS2812B-1010RGBC]
P402  WS2812B  [SMD LED WS2812B-1010RGBC]
P403  WS2812B  [SMD LED WS2812B-1010RGBC]
P404  WS2812B  [SMD LED WS2812B-1010RGBC]
P405  WS2812B  [SMD LED WS2812B-1010RGBC]
P406  WS2812B  [SMD LED WS2812B-1010RGBC]
P407  WS2812B  [SMD LED WS2812B-1010RGBC]
P408  WS2812B  [SMD LED WS2812B-1010RGBC]
P409  WS2812B  [SMD LED WS2812B-1010RGBC]
P410  WS2812B  [SMD LED WS2812B-1010RGBC]
P411  WS2812B  [SMD LED WS2812B-1010RGBC]
P412  WS2812B  [SMD LED WS2812B-1010RGBC]
P413  WS2812B  [SMD LED WS2812B-1010RGBC]
P414  WS2812B  [SMD LED WS2812B-1010RGBC]
P415  WS2812B  [SMD LED WS2812B-1010RGBC]
P416  WS2812B  [SMD LED WS2812B-1010RGBC]
P417  WS2812B  [SMD LED WS2812B-1010RGBC]
P418  WS2812B  [SMD LED WS2812B-1010RGBC]
P419  WS2812B  [SMD LED WS2812B-1010RGBC]
P420  WS2812B  [SMD LED WS2812B-1010RGBC]
P421  WS2812B  [SMD LED WS2812B-1010RGBC]
P422  WS2812B  [SMD LED WS2812B-1010RGBC]
P423  WS2812B  [SMD LED WS2812B-1010RGBC]
P424  WS2812B  [SMD LED WS2812B-1010RGBC]
P425  WS2812B  [SMD LED WS2812B-1010RGBC]
P426  WS2812B  [SMD LED WS2812B-1010RGBC]
P427  WS2812B  [SMD LED WS2812B-1010RGBC]
P428  WS2812B  [SMD LED WS2812B-1010RGBC]
P429  WS2812B  [SMD LED WS2812B-1010RGBC]
P430  WS2812B  [SMD LED WS2812B-1010RGBC]
P431  WS2812B  [SMD LED WS2812B-1010RGBC]
P432  WS2812B  [SMD LED WS2812B-1010RGBC]
P433  WS2812B  [SMD LED WS2812B-1010RGBC]
P434  WS2812B  [SMD LED WS2812B-1010RGBC]
P435  WS2812B  [SMD LED WS2812B-1010RGBC]
P436  WS2812B  [SMD LED WS2812B-1010RGBC]
P437  WS2812B  [SMD LED WS2812B-1010RGBC]
P438  WS2812B  [SMD LED WS2812B-1010RGBC]
P439  WS2812B  [SMD LED WS2812B-1010RGBC]
P440  WS2812B  [SMD LED WS2812B-1010RGBC]
P441  WS2812B  [SMD LED WS2812B-1010RGBC]
P442  WS2812B  [SMD LED WS2812B-1010RGBC]
P443  WS2812B  [SMD LED WS2812B-1010RGBC]
P444  WS2812B  [SMD LED WS2812B-1010RGBC]
P445  WS2812B  [SMD LED WS2812B-1010RGBC]
P446  WS2812B  [SMD LED WS2812B-1010RGBC]
P447  WS2812B  [SMD LED WS2812B-1010RGBC]
P448  WS2812B  [SMD LED WS2812B-1010RGBC]
P449  WS2812B  [SMD LED WS2812B-1010RGBC]
P450  WS2812B  [SMD LED WS2812B-1010RGBC]
P451  WS2812B  [SMD LED WS2812B-1010RGBC]
P452  WS2812B  [SMD LED WS2812B-1010RGBC]
P453  WS2812B  [SMD LED WS2812B-1010RGBC]
P454  WS2812B  [SMD LED WS2812B-1010RGBC]
P455  WS2812B  [SMD LED WS2812B-1010RGBC]
P456  WS2812B  [SMD LED WS2812B-1010RGBC]
P457  WS2812B  [SMD LED WS2812B-1010RGBC]
P458  WS2812B  [SMD LED WS2812B-1010RGBC]
P459  WS2812B  [SMD LED WS2812B-1010RGBC]
P460  WS2812B  [SMD LED WS2812B-1010RGBC]
P461  WS2812B  [SMD LED WS2812B-1010RGBC]
P462  WS2812B  [SMD LED WS2812B-1010RGBC]
P463  WS2812B  [SMD LED WS2812B-1010RGBC]
P464  WS2812B  [SMD LED WS2812B-1010RGBC]
P465  WS2812B  [SMD LED WS2812B-1010RGBC]
P466  WS2812B  [SMD LED WS2812B-1010RGBC]
P467  WS2812B  [SMD LED WS2812B-1010RGBC]
P468  WS2812B  [SMD LED WS2812B-1010RGBC]
P469  WS2812B  [SMD LED WS2812B-1010RGBC]
P470  WS2812B  [SMD LED WS2812B-1010RGBC]
P471  WS2812B  [SMD LED WS2812B-1010RGBC]
P472  WS2812B  [SMD LED WS2812B-1010RGBC]
P473  WS2812B  [SMD LED WS2812B-1010RGBC]
P474  WS2812B  [SMD LED WS2812B-1010RGBC]
P475  WS2812B  [SMD LED WS2812B-1010RGBC]
P476  WS2812B  [SMD LED WS2812B-1010RGBC]
P477  WS2812B  [SMD LED WS2812B-1010RGBC]
P478  WS2812B  [SMD LED WS2812B-1010RGBC]
P479  WS2812B  [SMD LED WS2812B-1010RGBC]
P480  WS2812B  [SMD LED WS2812B-1010RGBC]
P481  WS2812B  [SMD LED WS2812B-1010RGBC]
P482  WS2812B  [SMD LED WS2812B-1010RGBC]
P483  WS2812B  [SMD LED WS2812B-1010RGBC]
P484  WS2812B  [SMD LED WS2812B-1010RGBC]
P485  WS2812B  [SMD LED WS2812B-1010RGBC]
P486  WS2812B  [SMD LED WS2812B-1010RGBC]
P487  WS2812B  [SMD LED WS2812B-1010RGBC]
P488  WS2812B  [SMD LED WS2812B-1010RGBC]
P489  WS2812B  [SMD LED WS2812B-1010RGBC]
P490  WS2812B  [SMD LED WS2812B-1010RGBC]
P491  WS2812B  [SMD LED WS2812B-1010RGBC]
P492  WS2812B  [SMD LED WS2812B-1010RGBC]
P493  WS2812B  [SMD LED WS2812B-1010RGBC]
P494  WS2812B  [SMD LED WS2812B-1010RGBC]
P495  WS2812B  [SMD LED WS2812B-1010RGBC]
P496  WS2812B  [SMD LED WS2812B-1010RGBC]
P497  WS2812B  [SMD LED WS2812B-1010RGBC]
P498  WS2812B  [SMD LED WS2812B-1010RGBC]
P499  WS2812B  [SMD LED WS2812B-1010RGBC]
P500  WS2812B  [SMD LED WS2812B-1010RGBC]
P501  WS2812B  [SMD LED WS2812B-1010RGBC]
P502  WS2812B  [SMD LED WS2812B-1010RGBC]
P503  WS2812B  [SMD LED WS2812B-1010RGBC]
P504  WS2812B  [SMD LED WS2812B-1010RGBC]
P505  WS2812B  [SMD LED WS2812B-1010RGBC]
P506  WS2812B  [SMD LED WS2812B-1010RGBC]
P507  WS2812B  [SMD LED WS2812B-1010RGBC]
P508  WS2812B  [SMD LED WS2812B-1010RGBC]
P509  WS2812B  [SMD LED WS2812B-1010RGBC]
P510  WS2812B  [SMD LED WS2812B-1010RGBC]
P511  WS2812B  [SMD LED WS2812B-1010RGBC]
P512  WS2812B  [SMD LED WS2812B-1010RGBC]
P513  WS2812B  [SMD LED WS2812B-1010RGBC]
P514  WS2812B  [SMD LED WS2812B-1010RGBC]
P515  WS2812B  [SMD LED WS2812B-1010RGBC]
P516  WS2812B  [SMD LED WS2812B-1010RGBC]
P517  WS2812B  [SMD LED WS2812B-1010RGBC]
P518  WS2812B  [SMD LED WS2812B-1010RGBC]
P519  WS2812B  [SMD LED WS2812B-1010RGBC]
P520  WS2812B  [SMD LED WS2812B-1010RGBC]
P521  WS2812B  [SMD LED WS2812B-1010RGBC]
P522  WS2812B  [SMD LED WS2812B-1010RGBC]
P523  WS2812B  [SMD LED WS2812B-1010RGBC]
P524  WS2812B  [SMD LED WS2812B-1010RGBC]
P525  WS2812B  [SMD LED WS2812B-1010RGBC]
P526  WS2812B  [SMD LED WS2812B-1010RGBC]
P527  WS2812B  [SMD LED WS2812B-1010RGBC]
P528  WS2812B  [SMD LED WS2812B-1010RGBC]
P529  WS2812B  [SMD LED WS2812B-1010RGBC]
P530  WS2812B  [SMD LED WS2812B-1010RGBC]
P531  WS2812B  [SMD LED WS2812B-1010RGBC]
P532  WS2812B  [SMD LED WS2812B-1010RGBC]
P533  WS2812B  [SMD LED WS2812B-1010RGBC]
P534  WS2812B  [SMD LED WS2812B-1010RGBC]
P535  WS2812B  [SMD LED WS2812B-1010RGBC]
P536  WS2812B  [SMD LED WS2812B-1010RGBC]
P537  WS2812B  [SMD LED WS2812B-1010RGBC]
P538  WS2812B  [SMD LED WS2812B-1010RGBC]
P539  WS2812B  [SMD LED WS2812B-1010RGBC]
P540  WS2812B  [SMD LED WS2812B-1010RGBC]
P541  WS2812B  [SMD LED WS2812B-1010RGBC]
P542  WS2812B  [SMD LED WS2812B-1010RGBC]
P543  WS2812B  [SMD LED WS2812B-1010RGBC]
P544  WS2812B  [SMD LED WS2812B-1010RGBC]
P545  WS2812B  [SMD LED WS2812B-1010RGBC]
P546  WS2812B  [SMD LED WS2812B-1010RGBC]
P547  WS2812B  [SMD LED WS2812B-1010RGBC]
P548  WS2812B  [SMD LED WS2812B-1010RGBC]

### Ports
LED_MAT (in), LED_SIGN (in)